# Altium schematic sheet REVERSION HISTORY.SchDoc: REVERSION HISTORY
size A3; Author: DODANHLUONG; Revision: 1.0; SheetNumber: 1; SheetTotal: 6; ProjectTitle: ESP32_C3_VERSION_1
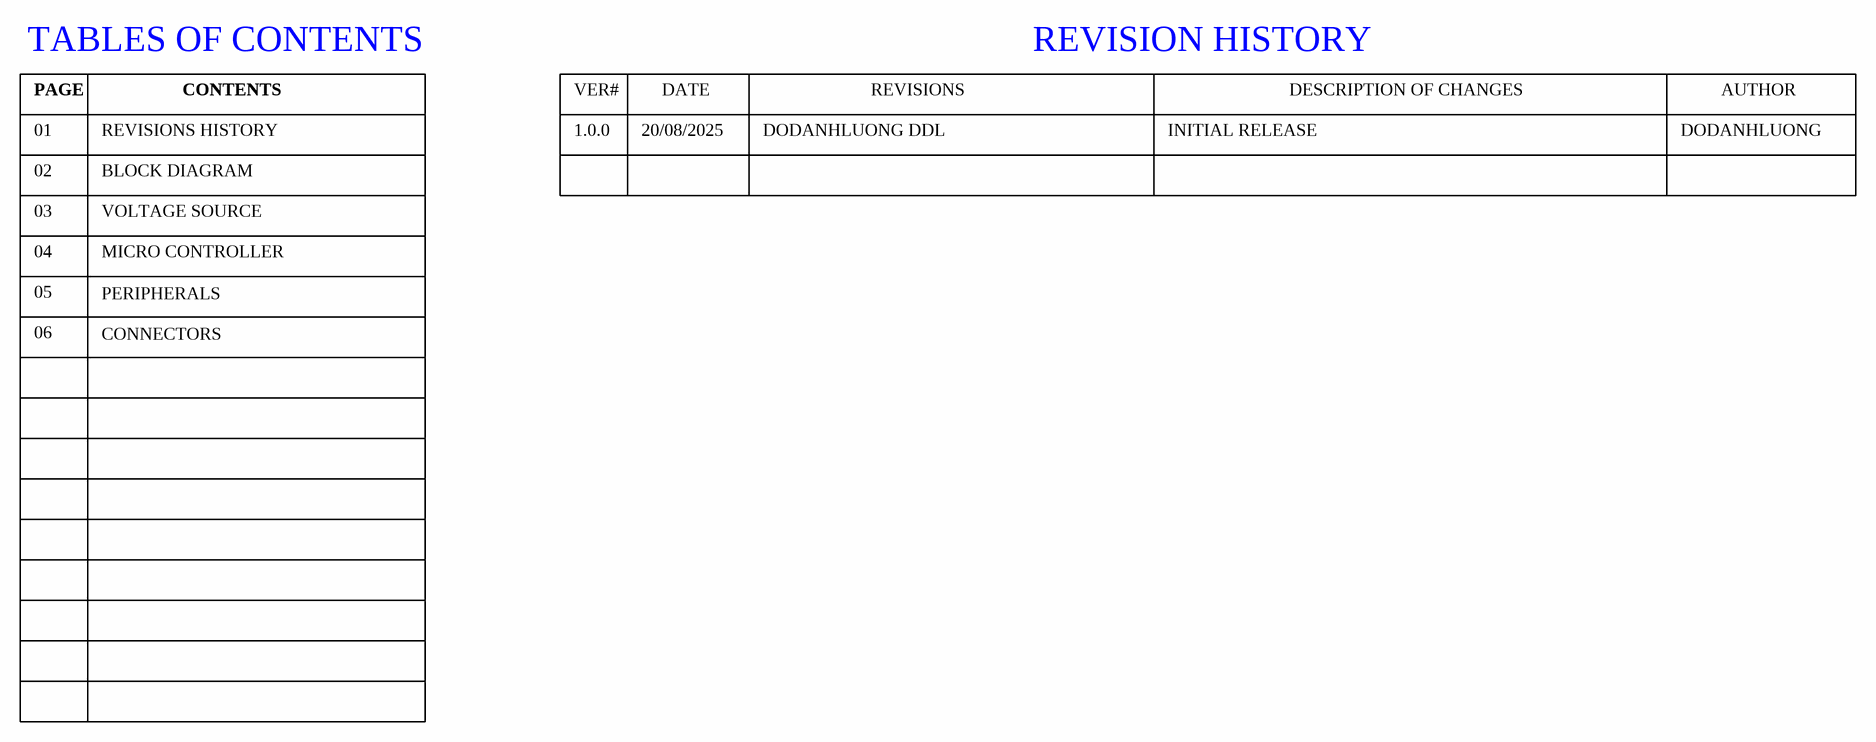
[diagram p0: REVERSION HISTORY.SchDoc]

## Notes on the sheet
- TABLES OF CONTENTS
- PAGE
- CONTENTS
- VER#
- DATE
- REVISIONS
- REVISION HISTORY
- DESCRIPTION OF CHANGES
- AUTHOR
- 01
- REVISIONS HISTORY
- 1.0.0
- 20/08/2025
- DODANHLUONG DDL
- INITIAL RELEASE
- DODANHLUONG
- 02
- 03
- BLOCK DIAGRAM
- VOLTAGE SOURCE
- 04
- 05
- MICRO CONTROLLER
- PERIPHERALS
- 06
- CONNECTORS
- Author:
- Title:
- Size:
- A3
- Project:
- Revision:
- Modified Date:
- CheckedBy:
- Date:
- SW Version: